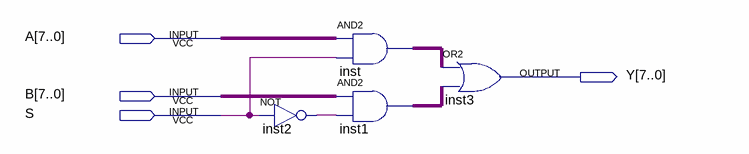
[diagram p0: schematic sheet]
// Quartus schematic 8mux21.bdf as structural Verilog: 4 symbols, 4 pins
module \8mux21  (
  input  [7:0] A,
  input  [7:0] B,
  input  S,
  output [7:0] Y
);

  wire inst2_out;
  wire [7:0] inst1_out, inst_out;

  not inst2 (inst2_out, S);
  assign inst_out = A & {8{S}};  // AND2 inst, 8 bits wide
  assign inst1_out = B & {8{inst2_out}};  // AND2 inst1, 8 bits wide
  assign Y = inst_out | inst1_out;  // OR2 inst3, 8 bits wide
endmodule
